# EAGLE schematic kkClave (EAGLE 9.3.2)
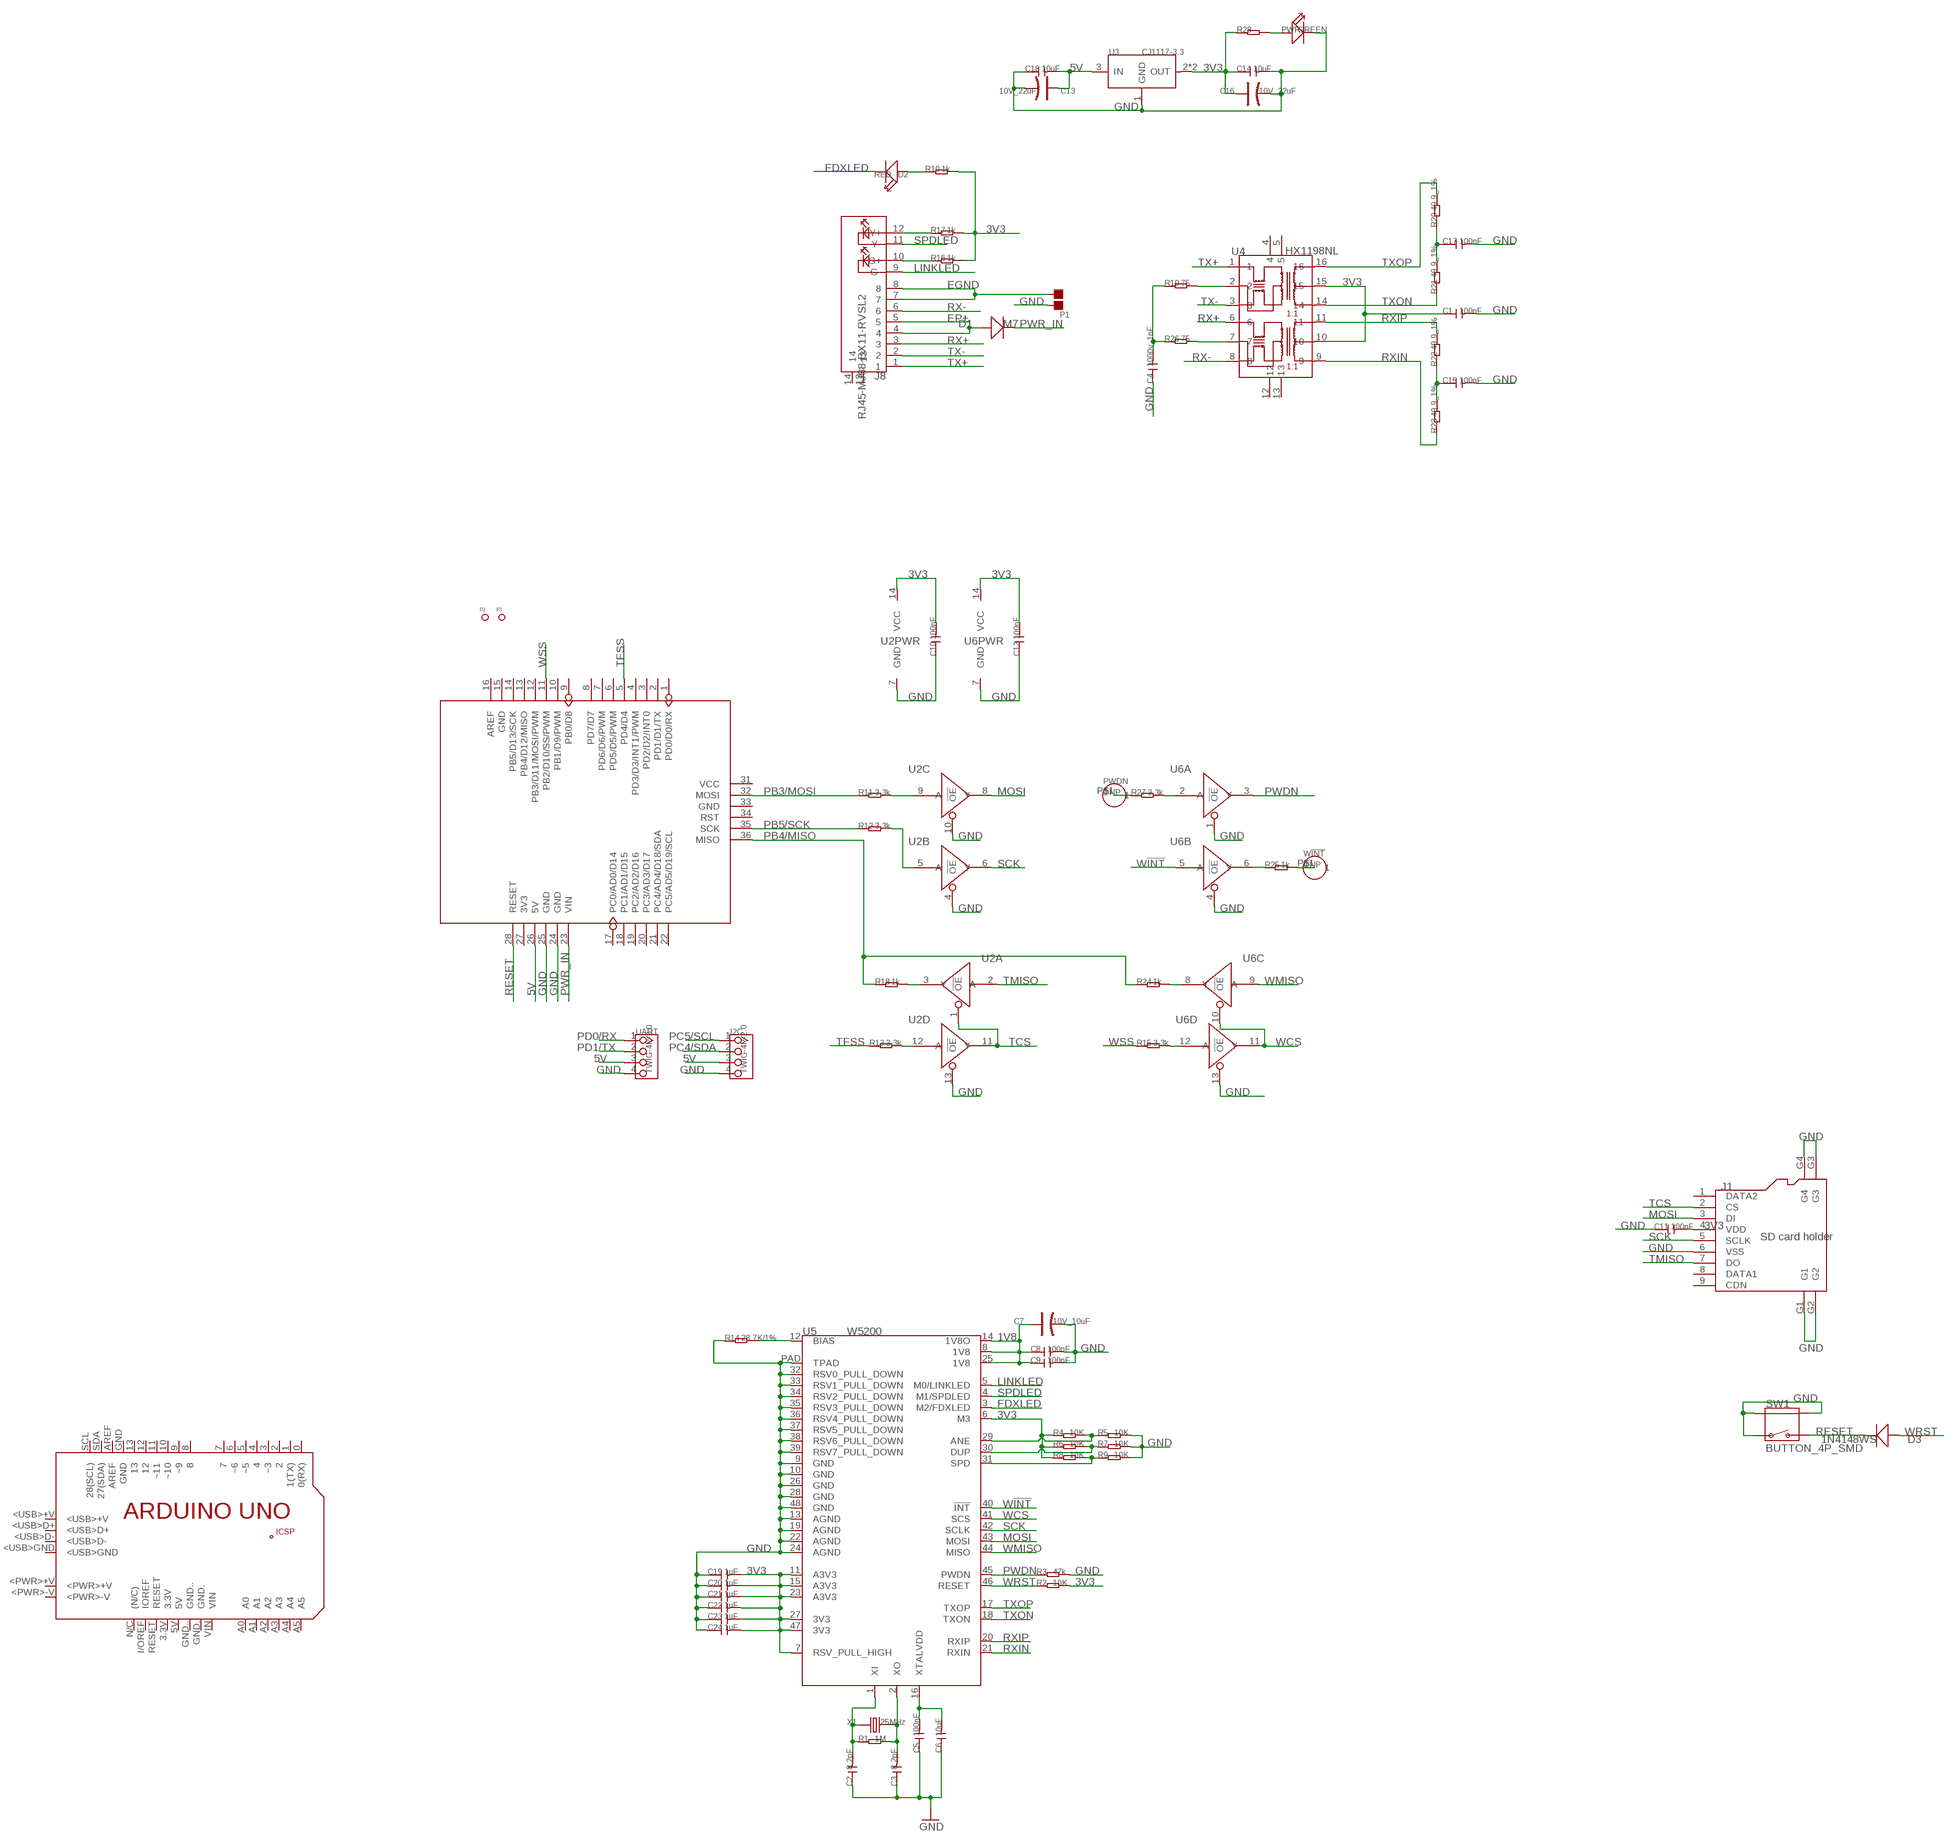
[diagram p0: schematic, sheet 1]

## Parts
C1  100nF  C-0603  [C0603]
C2  8.2pF  C-0603  [C0603]
C3  8.2pF  C-0603  [C0603]
C4  1000v_1nF  C-1206  [C1206]
C5  100nF  C-0603  [C0603]
C6  10uF  C-0805  [C0805]
C7  10V_10uF  CAP-AVX-A  [AVX-A]
C8  100nF  C-0603  [C0603]
C9  100nF  C-0603  [C0603]
C10  100nF  C-0603  [C0603]
C11  100nF  C-0603  [C0603]
C12  100nF  C-0603  [C0603]
C13  10V_22uF  CAP-AVX-B  [AVX-B]
C14  10uF  C-0805  [C0805]
C15  100nF  C-0603  [C0603]
C16  10V_22uF  CAP-AVX-B  [AVX-B]
C17  100nF  C-0603  [C0603]
C18  10uF  C-0805  [C0805]
C19  1uF  C-0805  [C0805]
C20  1uF  C-0805  [C0805]
C21  1uF  C-0805  [C0805]
C22  1uF  C-0805  [C0805]
C23  1uF  C-0805  [C0805]
C24  1uF  C-0805  [C0805]
D1  M7  D'SMA'  [D2010]
D2  RED  LED'0603'  [LED-0603]
D3  1N4148WS  D'0805'  [SOD323]
I2C  TWIG-4P-2.0  TWIG-4P-2.0-2.0  [4P-2.0]
J1  SD card holder  HOLDER-MICROSD-9P  [9P-SMD-W/-RING]
J8  RJ45-MJ88-BX11-RVSL2  [RJ45-MJ88-BX11-RVSL2]
P1  DNP  PAD-JUMPER-2P  [2P-SMD-1.78X1.27]
P2  PAD-MARK  [ROUND-MARK-1.0]
P3  PAD-MARK  [ROUND-MARK-1.0]
PCB1  ARDUINO_UNO  [ARDUINO_UNO]
PWDN  DNP  HEADER-1P-35  [1P-65/35MIL]
PWR  GREEN  LED'0603'  [LED-0603]
R1  1M  R-0603  [R0603]
R2  10K  R-0603  [R0603]
R3  47k  R-0603  [R0603]
R4  10K  R-0603  [R0603]
R5  10K  R-0603  [R0603]
R6  10K  R-0603  [R0603]
R7  10K  R-0603  [R0603]
R8  10K  R-0603  [R0603]
R9  10K  R-0603  [R0603]
R10  1k  R-0603  [R0603]
R11  3.3k  R-0603  [R0603]
R12  3.3k  R-0603  [R0603]
R13  3.3k  R-0603  [R0603]
R14  28.7K/1%  R-0603  [R0603]
R15  3.3k  R-0603  [R0603]
R16  1k  R-0603  [R0603]
R17  1k  R-0603  [R0603]
R18  1k  R-0603  [R0603]
R19  75  R-0603  [R0603]
R20  49.9_1%  R-0603  [R0603]
R21  49.9_1%  R-0603  [R0603]
R22  49.9_1%  R-0603  [R0603]
R23  49.9_1%  R-0603  [R0603]
R24  1k  R-0603  [R0603]
R25  1k  R-0603  [R0603]
R26  75  R-0603  [R0603]
R27  3.3k  R-0603  [R0603]
R28  R-0603  [R0603]
SW1  BUTTON_4P_SMD  [4P-SMD-7X3.5X3.5]
U1  ARDUINO  [ARDUINO]
U2  74VHC125PW  [TSSOP14]
U3  CJ1117-3.3  LD1117S  [SOT-223]
U4  HX1198NL  [SOIC16-9.53]
U5  W5200  [QFN48]
U6  74VHC125PW  [TSSOP14]
UART  TWIG-4P-2.0  TWIG-4P-2.0-2.0  [4P-2.0]
W!INT  DNP  HEADER-1P-35  [1P-65/35MIL]
X1  25MHz  CRYSTAL'5032'  [2P-SMD-5X3.2]

## Nets
1V8: C7.+ C8.1 C9.1 U5.8(1V8) U5.14(1V8O) U5.25(1V8)
3V3: C1.1 C10.2 C11.2 C12.2 C14.1 C16.+ C19.2 C20.2 C21.2 C22.2 C23.2 C24.2 J1.4(VDD) R2.2 R4.1 R6.1 R8.1 R10.2 R16.2 R17.2 R28.1 U2.14(PWR:VCC) U3.2(OUT) U3.TER(OUT) U4.10 U4.15 U5.6(M3) U5.7(RSV_PULL_HIGH) U5.11(A3V3) U5.15(A3V3) U5.23(A3V3) U5.27(3V3) U5.47(3V3) U6.14(PWR:VCC)
5V [usbvcc]: C13.+ C18.2 I2C.3 U1.26(5V) U3.3(IN) UART.3
EGND [power]: J8.7 J8.8 P1.1
EP+: D1.+ J8.4 J8.5
FDXLED: D2.- U5.3(M2/FDXLED)
GND: C1.2 C2.1 C3.1 C4.1 C5.1 C6.1 C7.- C8.2 C9.2 C10.1 C11.1 C12.1 C13.- C14.2 C15.2 C16.- C17.2 C18.1 C19.1 C20.1 C21.1 C22.1 C23.1 C24.1 I2C.4 J1.6(VSS) J1.G1 J1.G2 J1.G3 J1.G4 P1.2 PWR.- R3.2 R5.2 R7.2 R9.2 R14.1 SW1.1 SW1.S1 SW1.S2 U1.24(GND) U1.25(GND) U2.4(B:!OE) U2.7(PWR:GND) U2.10(C:!OE) U2.13(D:!OE) U3.1(GND) U5.9(GND) U5.10(GND) U5.13(AGND) U5.19(AGND) U5.22(AGND) U5.24(AGND) U5.26(GND) U5.28(GND) U5.32(RSV0_PULL_DOWN) U5.33(RSV1_PULL_DOWN) U5.34(RSV2_PULL_DOWN) U5.35(RSV3_PULL_DOWN) U5.36(RSV4_PULL_DOWN) U5.37(RSV5_PULL_DOWN) U5.38(RSV6_PULL_DOWN) U5.39(RSV7_PULL_DOWN) U5.48(GND) U5.PAD(TPAD) U6.1(A:!OE) U6.4(B:!OE) U6.7(PWR:GND) U6.13(D:!OE) UART.4
LINKLED: J8.9(G-) U5.5(M0/LINKLED)
MOSI: J1.3(DI) U2.8(C:Y) U5.43(MOSI)
N$1: C2.2 R1.1 U5.1(XI) X1.1
N$2: C3.2 R1.2 U5.2(XO) X1.2
N$3: R4.2 R5.1 U5.29(ANE)
N$4: R6.2 R7.1 U5.30(DUP)
N$5: R8.2 R9.1 U5.31(SPD)
N$6: D2.+ R10.1
N$7: R12.2 U2.5(B:A)
N$8: R11.2 U2.9(C:A)
N$9: R13.2 U2.12(D:A)
N$10: R15.2 U6.12(D:A)
N$11: R26.2 U4.7
N$12: R19.2 U4.2
N$13: C4.2 R19.1 R26.1
N$14: R18.2 U2.3(A:Y)
N$15: C15.1 R22.1 R23.2
N$16: C17.1 R20.1 R21.2
N$17: R24.2 U6.8(C:Y)
N$18: J8.12(Y+) R17.1
N$19: J8.10(G+) R16.1
N$20: R25.1 U6.6(B:Y)
N$21: R25.2 W!INT.P$1
N$22: C5.2 C6.2 U5.16(XTALVDD)
N$23: R14.2 U5.12(BIAS)
N$24: R27.2 U6.2(A:A)
N$25: PWDN.P$1 R27.1
N$26: PWR.+ R28.2
PB3/MOSI: R11.1 U1.32(MOSI)
PB4/MISO: R18.1 R24.1 U1.36(MISO)
PB5/SCK: R12.1 U1.35(SCK)
PC4/SDA: I2C.2
PC5/SCL: I2C.1
PD0/RX: UART.1
PD1/TX: UART.2
PWDN: R3.1 U5.45(PWDN) U6.3(A:Y)
PWR_IN: D1.- U1.23(VIN)
RESET: D3.- SW1.2 U1.28(RESET)
RX+: J8.3 U4.6
RX-: J8.6 U4.8
RXIN: R23.1 U4.9 U5.21(RXIN)
RXIP: R22.2 U4.11 U5.20(RXIP)
SCK: J1.5(SCLK) U2.6(B:Y) U5.42(SCLK)
SPDLED: J8.11(Y-) U5.4(M1/SPDLED)
TCS: J1.2(CS) U2.1(A:!OE) U2.11(D:Y)
TFSS: R13.1 U1.5(PD4/D4)
TMISO: J1.7(DO) U2.2(A:A)
TX+: J8.1 U4.1
TX-: J8.2 U4.3
TXON: R21.1 U4.14 U5.18(TXON)
TXOP: R20.2 U4.16 U5.17(TXOP)
W!INT: U5.40(!INT) U6.5(B:A)
WCS: U5.41(SCS) U6.10(C:!OE) U6.11(D:Y)
WMISO: U5.44(MISO) U6.9(C:A)
WRST: D3.+ R2.1 U5.46(RESET)
WSS: R15.1 U1.11(PB2/D10/SS/PWM)
Unconnected: J1.1(DATA2) J1.8(DATA1) J1.9(CDN) J8.13 J8.14 PCB1.0(0(RX)) PCB1.1(1(TX)) PCB1.2 PCB1.3(~3) PCB1.3.3V PCB1.4 PCB1.5(~5) PCB1.5V PCB1.6(~6) PCB1.7 PCB1.8 PCB1.9(~9) PCB1.10(~10) PCB1.11(~11) PCB1.12 PCB1.13 PCB1.+5V PCB1.<PWR>+V PCB1.<PWR>-V PCB1.<USB>+V PCB1.<USB>D+ PCB1.<USB>D- PCB1.<USB>GND PCB1.A0 PCB1.A1 PCB1.A2 PCB1.A3 PCB1.A4 PCB1.A5 PCB1.AREF PCB1.GND PCB1.GND. PCB1.GND.. PCB1.GND_ PCB1.I/OREF(IOREF) PCB1.MISO PCB1.MOSI PCB1.N/C((N/C)) PCB1.RESET PCB1.RESET. PCB1.SCK PCB1.SCL(28(SCL)) PCB1.SDA(27(SDA)) PCB1.VIN U1.1(PD0/D0/RX) U1.2(PD1/D1/TX) U1.3(PD2/D2/INT0) U1.4(PD3/D3/INT1/PWM) U1.6(PD5/D5/PWM) U1.7(PD6/D6/PWM) U1.8(PD7/D7) U1.9(PB0/D8) U1.10(PB1/D9/PWM) U1.12(PB3/D11/MOSI/PWM) U1.13(PB4/D12/MISO) U1.14(PB5/D13/SCK) U1.15(GND) U1.16(AREF) U1.17(PC0/AD0/D14) U1.18(PC1/AD1/D15) U1.19(PC2/AD2/D16) U1.20(PC3/AD3/D17) U1.21(PC4/AD4/D18/SDA) U1.22(PC5/AD5/D19/SCL) U1.27(3V3) U1.31(VCC) U1.33(GND) U1.34(RST) U4.4 U4.5 U4.12 U4.13

## Library data of the parts
C1-C6 C8-C12 C14 C15 C17-C24 = Discrete:C*: Ceramic Capacitors
C7 C13 C16 = Discrete:CAP*: Electrolytic Capacitors,Tantalum Capacitors and Super Capacitors
D1 D3 = Discrete:D*
D2 PWR = Discrete:LED*
I2C UART = Connector:TWIG-4P-2.0
J1 = Connector:HOLDER-MICROSD-9P
J8 = Connector:RJ45-MJ88-BX11-RVSL2: Modular Jack 8P8C,R/A,With LED
P1 = Discrete:PAD-JUMPER-2P; PARTNO: DNP
P2 P3 = Discrete:PAD-MARK; PARTNO: DNP
PCB1 = E14_Arduino_revC:ARDUINO_UNO: Device for representing an Arduino Uno board with a footprint in an EAGLE design. Created by Dave Young for Element14. More EAGLE documentation at: http://www.element14.com/community/community/knode/cadsoft_eagle
PWDN W!INT = Connector:HEADER-1P
R1-R28 = Discrete:R*
SW1 = For_Test_Albert_v6:BUTTON_4P_SMD: TS-1188E http://www.best-dz.com/?thread-374-2.html
U1 = moudle:ARDUINO
U2 U6 = IC:74V*125: Quad Buffer/Line Driver;3-state
U3 = IC:LD1117: Low Drop Fixed And Adjustable Positive Voltage Regulators http://www.datasheetcatalog.org/datasheet/SGSThomsonMicroelectronics/mXuqtqv.pdf
U4 = IC:HX1198NL: 10/100BASE-T Single Port Surface Mount Magnetics With Various Turns Ratios
U5 = For_Test_Albert_v6:W5200
X1 = Discrete:CRYSTAL*: CRYSTAL

## Net classes
0 default: width 0.152 mm, drill 0.305 mm, clearance 0.152 mm
3 usbvcc: width 0.203 mm, drill 0.305 mm, clearance 0.203 mm